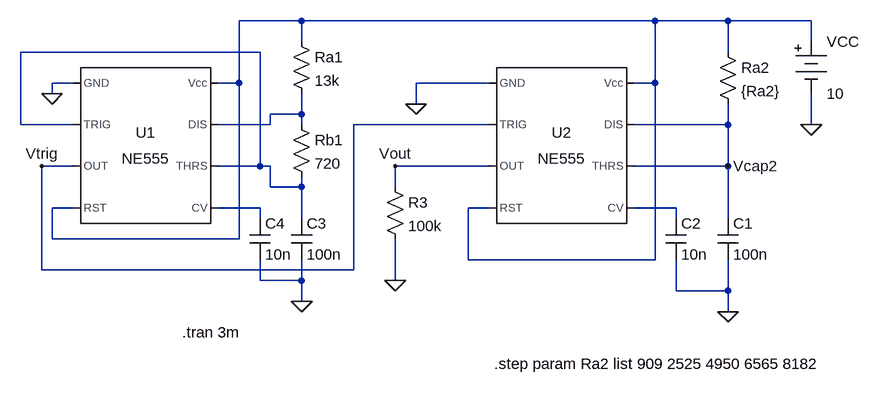
[diagram p0: schematic 3_12_pablo_gomez_tp7_ej3_test.asc]
3_12_pablo_gomez_tp7_ej3_test.asc, the LTspice schematic file:
Version 4
SHEET 1 880 680
WIRE -272 -48 -368 -48
WIRE 272 -48 -272 -48
WIRE 384 -48 272 -48
WIRE 512 -48 384 -48
WIRE -272 -16 -272 -48
WIRE 512 -16 512 -48
WIRE -336 0 -704 0
WIRE 384 0 384 -48
WIRE -624 48 -656 48
WIRE -368 48 -368 -48
WIRE -368 48 -400 48
WIRE 16 48 -96 48
WIRE 272 48 272 -48
WIRE 272 48 240 48
WIRE -656 64 -656 48
WIRE -96 80 -96 48
WIRE -272 96 -272 64
WIRE -272 96 -320 96
WIRE -704 112 -704 0
WIRE -624 112 -704 112
WIRE -320 112 -320 96
WIRE -320 112 -400 112
WIRE -272 112 -272 96
WIRE 16 112 -192 112
WIRE 384 112 384 80
WIRE 384 112 240 112
WIRE 512 112 512 64
WIRE -624 176 -672 176
WIRE -336 176 -336 0
WIRE -336 176 -400 176
WIRE -320 176 -336 176
WIRE 16 176 -128 176
WIRE 384 176 384 112
WIRE 384 176 240 176
WIRE -320 208 -320 176
WIRE -272 208 -272 192
WIRE -272 208 -320 208
WIRE -128 208 -128 176
WIRE -624 240 -656 240
WIRE -336 240 -400 240
WIRE 16 240 -16 240
WIRE 304 240 240 240
WIRE -336 256 -336 240
WIRE -272 256 -272 208
WIRE 304 256 304 240
WIRE 384 256 384 176
WIRE -656 288 -656 240
WIRE -368 288 -368 48
WIRE -368 288 -656 288
WIRE -16 320 -16 240
WIRE 272 320 272 48
WIRE 272 320 -16 320
WIRE -672 336 -672 176
WIRE -192 336 -192 112
WIRE -192 336 -672 336
WIRE -336 352 -336 320
WIRE -272 352 -272 320
WIRE -272 352 -336 352
WIRE -128 352 -128 288
WIRE 304 368 304 320
WIRE 384 368 384 320
WIRE 384 368 304 368
WIRE -272 384 -272 352
WIRE 384 400 384 368
FLAG 512 112 0
FLAG 384 400 0
FLAG -96 80 0
FLAG -128 352 0
FLAG -128 176 Vout
FLAG -656 64 0
FLAG -272 384 0
FLAG -672 176 Vtrig
FLAG 384 176 Vcap2
SYMBOL Misc\\NE555 -512 144 R0
SYMATTR InstName U1
SYMBOL Misc\\battery 512 -32 R0
WINDOW 123 0 0 Left 0
WINDOW 39 0 0 Left 0
SYMATTR InstName VCC
SYMATTR Value 10
SYMBOL res 368 -16 R0
SYMATTR InstName Ra2
SYMATTR Value {Ra2}
SYMBOL cap 368 256 R0
SYMATTR InstName C1
SYMATTR Value 100n
SYMBOL res -144 192 R0
SYMATTR InstName R3
SYMATTR Value 100k
SYMBOL cap 288 256 R0
SYMATTR InstName C2
SYMATTR Value 10n
SYMBOL Misc\\NE555 128 144 R0
SYMATTR InstName U2
SYMBOL res -288 -32 R0
SYMATTR InstName Ra1
SYMATTR Value 13k
SYMBOL res -288 96 R0
SYMATTR InstName Rb1
SYMATTR Value 720
SYMBOL cap -288 256 R0
SYMATTR InstName C3
SYMATTR Value 100n
SYMBOL cap -352 256 R0
SYMATTR InstName C4
SYMATTR Value 10n
TEXT -456 432 Left 2 !.tran 3m
TEXT 24 480 Left 2 !.step param Ra2 list 909 2525 4950 6565 8182

The netlist it stands for:
* 3_12_pablo_gomez_tp7_ej3_test.asc
XU1 0 N002 Vtrig N001 N004 N002 N003 N001 NE555  ; pins GND TRIG OUT RST CV THRS DIS Vcc
VCC N001 0 10
Ra2 N001 Vcap2 {Ra2}
C1 Vcap2 0 100n
R3 Vout 0 100k
C2 N005 0 10n
XU2 0 Vtrig Vout N001 N005 Vcap2 Vcap2 N001 NE555  ; pins GND TRIG OUT RST CV THRS DIS Vcc
Ra1 N001 N003 13k
Rb1 N003 N002 720
C3 N002 0 100n
C4 N004 0 10n
.tran 3m
.step param Ra2 list 909 2525 4950 6565 8182
.lib NE555.sub
.backanno
.end